# EAGLE design reg_MIC29752 (EAGLE 9.4.1)
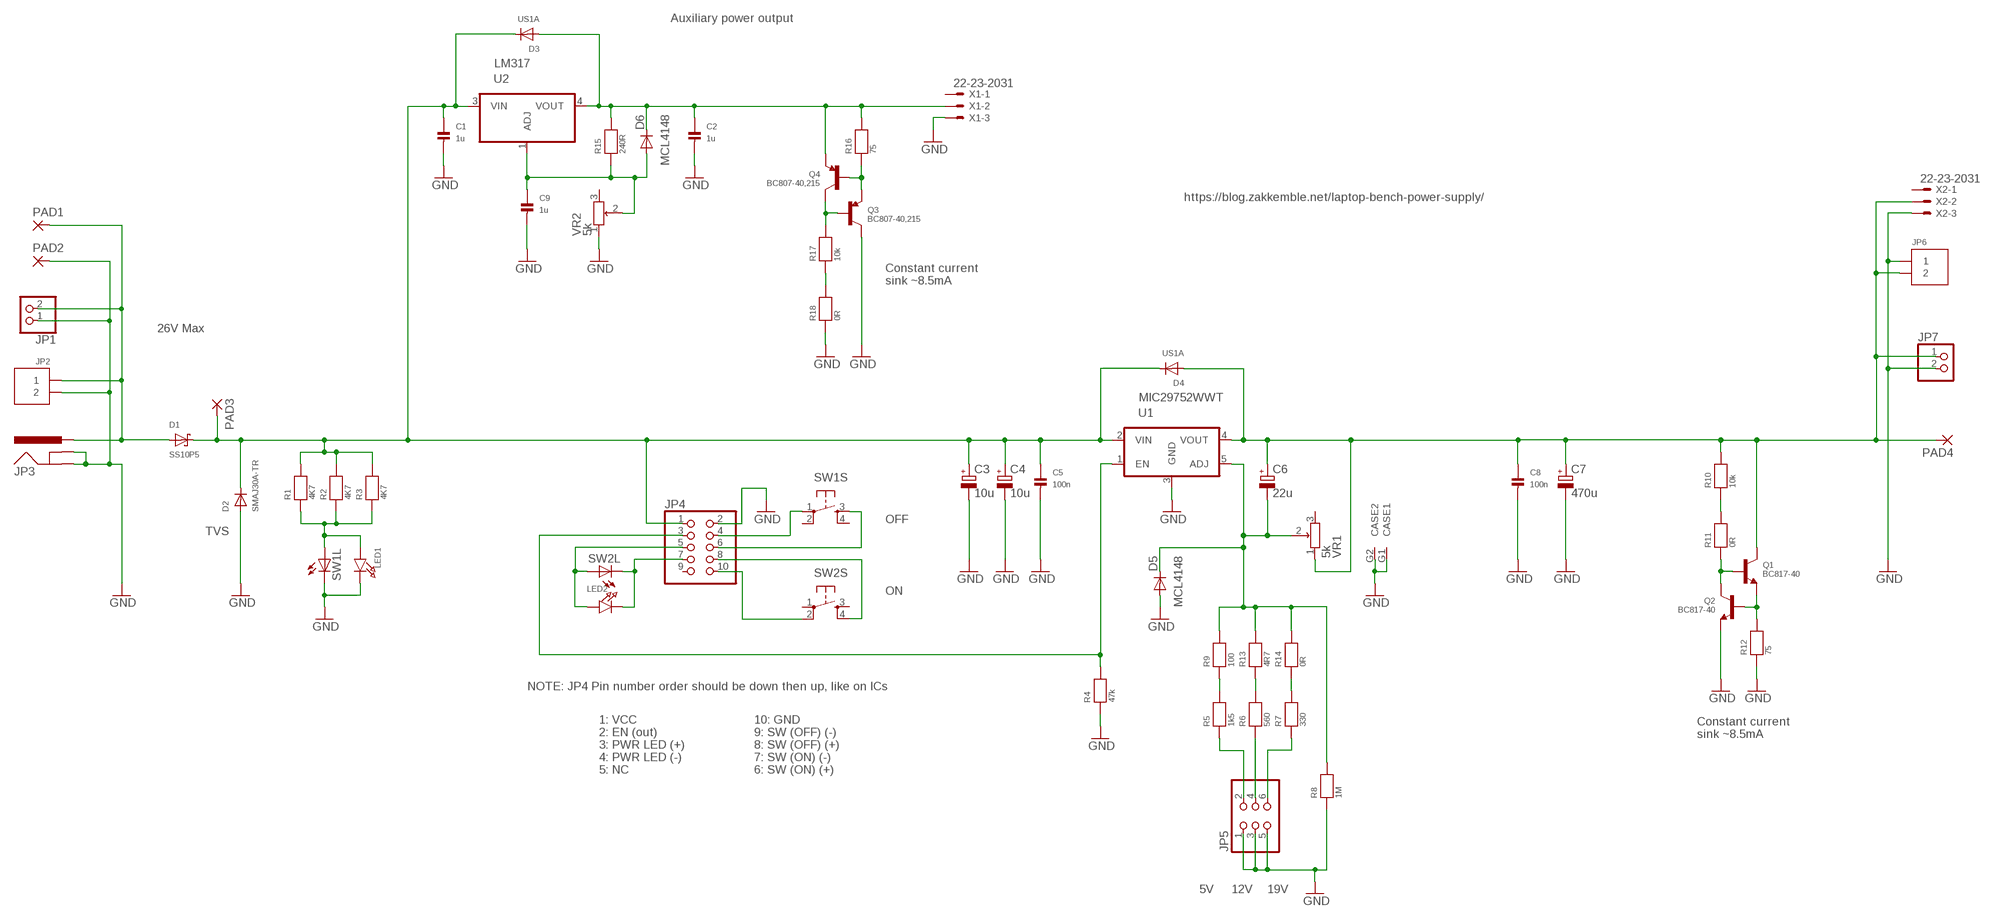
[diagram p0: schematic, sheet 1]

## Parts
C1  1u  CAP_CERAMIC0805  [0805_NO_OUTLINE]
C2  1u  CAP_CERAMIC0805  [0805_NO_OUTLINE]
C3  10u  CPOL-EUE2-5  [E2-5]
C4  10u  CPOL-EUE2-5  [E2-5]
C5  100n  CAP_CERAMIC_0603MP  [_0603MP]
C6  22u  CPOL-EUE2-4  [E2-4]
C7  470u  CPOL-EUE5-10.5  [E5-10,5]
C8  100n  CAP_CERAMIC_0603MP  [_0603MP]
C9  1u  CAP_CERAMIC0805  [0805_NO_OUTLINE]
D1  SS10P5  DIODE-SCHOTTKYTO-277A  [TO-277A]
D2  SMAJ30A-TR  DIODESMA  [SMADIODE]
D3  US1A  DIODESMA  [SMADIODE]
D4  US1A  DIODESMA  [SMADIODE]
D5  MCL4148  DIODE-MICROMELF-R  [MICROMELF-R]
D6  MCL4148  DIODE-MICROMELF-R  [MICROMELF-R]
JP1  PINHD-1X2  [1X02]
JP2  TERM_BLOCK_2WAY  [TERM_2WAY]
JP3  POWER_JACKPTH_HIGHCURRENT  [POWER_JACK_PTH_HIGHCURRENT]
JP4  PINHD-2X5  [2X05]
JP5  PINHD-2X3  [2X03]
JP6  TERM_BLOCK_2WAY  [TERM_2WAY]
JP7  PINHD-1X2  [1X02]
LED1  LED0603_NOOUTLINE  [CHIPLED_0603_NOOUTLINE]
LED2  LED0603_NOOUTLINE  [CHIPLED_0603_NOOUTLINE]
PAD1  WIREPAD-3.81,2SCREW-3MM  [SCREWPAD-3MM]
PAD2  WIREPAD-3.81,2SCREW-3MM  [SCREWPAD-3MM]
PAD3  WIREPAD-3.81,2SCREW-3MM  [SCREWPAD-3MM]
PAD4  WIREPAD-3.81,2SCREW-3MM  [SCREWPAD-3MM]
Q1  BC817-40  TRANSISTOR_NPNWAVE  [SOT23-W]
Q2  BC817-40  TRANSISTOR_NPNWIDE  [SOT23-WIDE]
Q3  BC807-40,215  TRANSISTOR_PNPSOT23-WAVE  [SOT23-W]
Q4  BC807-40,215  TRANSISTOR_PNPWIDE  [SOT23-WIDE]
R1  4K7  RESISTOR0402  [0402]
R2  4K7  RESISTOR0402  [0402]
R3  4K7  RESISTOR0402  [0402]
R4  47k  RESISTOR0402  [0402]
R5  1k5  RESISTOR0402  [0402]
R6  560  RESISTOR0402  [0402]
R7  330  RESISTOR0402  [0402]
R8  1M  RESISTOR0402  [0402]
R9  100  RESISTOR0402  [0402]
R10  10k  RESISTOR0402  [0402]
R11  0R  RESISTOR0402  [0402]
R12  75  RESISTOR0402  [0402]
R13  4R7  RESISTOR0402  [0402]
R14  0R  RESISTOR0402  [0402]
R15  240R  RESISTOR0402  [0402]
R16  75  RESISTOR0402  [0402]
R17  10k  RESISTOR0402  [0402]
R18  0R  RESISTOR0402  [0402]
SW1  SPST_TACT_LED12MM_TH  [TACT_TH_12MM_LED]
SW2  SPST_TACT_LED12MM_TH  [TACT_TH_12MM_LED]
U1  MIC29752WWT  REGULATOR_3_ADJ_ENTO247-5-REVERSE  [TO247-5-REVERSE]
U2  LM317  REGULATOR_3_ADJDPAK  [DPAK]
VR1  5k  POTENTIOMETER_RV09RV09  [RV09]
VR2  5k  POTENTIOMETERBOURNS3MM  [TRIMPOT_BOURNS3MM]
X1  22-23-2031  [22-23-2031]
X2  22-23-2031  [22-23-2031]

## Nets
GND: C1.2 C2.2 C3.- C4.- C5.2 C7.- C8.2 C9.2 D2.A D5.A JP1.1 JP2.2 JP3.C1(GNDBREAK) JP3.C2(GNDBREAK) JP3.C3(GNDBREAK) JP3.C4(GNDBREAK) JP3.GND JP4.2 JP5.1 JP5.3 JP5.5 JP6.1 JP7.2 LED1.C PAD2.1(P) Q2.2(E) Q3.3(C) R4.1 R8.1 R12.1 R18.1 SW1.5(L:C) U1.3(GND) VR1.G1(CASE1) VR1.G2(CASE2) VR2.1(1A) X1.3 X2.3
N$1: C1.1 C3.+ C4.+ C5.1 D1.K(C) D2.C D3.C D4.C JP4.1 PAD3.1(P) R1.2 R2.2 R3.2 U1.2(VIN) U2.3(VIN)
N$2: LED1.A R1.1 R2.1 R3.1 SW1.6(L:A)
N$3: D1.1(A) D1.2(A) JP1.2 JP2.1 JP3.PWR PAD1.1(P)
N$4: R5.2 R9.1
N$5: JP4.7 LED2.C SW2.5(L:C)
N$6: R10.1 R11.2
N$7: R6.2 R13.1
N$8: JP4.10 SW2.2(S:P1)
N$9: JP4.8 SW2.4(S:S1)
N$10: C2.1 D3.A D6.C Q4.2(E) R15.2 R16.2 U2.4(VOUT) X1.2
N$11: R7.2 R14.1
N$12: JP4.6 SW1.3(S:S)
N$13: JP4.4 SW1.1(S:P)
N$14: C6.- D5.C R8.2 R9.2 R13.2 R14.2 U1.5(ADJ) VR1.2(1S)
N$16: JP5.6 R7.1
N$17: JP5.4 R6.1
N$18: C9.1 D6.A R15.1 U2.1(ADJ) VR2.2(1S)
N$19: C6.+ C7.+ C8.1 D4.A JP6.2 JP7.1 PAD4.1(P) Q1.3(C) R10.2 U1.4(VOUT) VR1.1(1A) X2.2
N$20: JP5.2 R5.1
N$21: Q1.2(E) Q2.1(B) R12.2
N$22: Q1.1(B) Q2.3(C) R11.1
N$23: Q3.2(E) Q4.1(B) R16.1
N$24: Q3.1(B) Q4.3(C) R17.2
N$25: R17.1 R18.2
N$29: JP4.3 R4.2 U1.1(EN)
N$30: JP4.5 LED2.A SW2.6(L:A)
Unconnected: JP4.9 SW1.2(S:P1) SW1.4(S:S1) SW2.1(S:P) SW2.3(S:S) VR1.3(1E) VR2.3(1E) X1.1 X2.1

## Notes on the sheet
- Auxiliary power output
- https://blog.zakkemble.net/laptop-bench-power-supply/
- Constant current
  sink ~8.5mA
- 26V Max
- OFF
- TVS
- ON
- NOTE: JP4 Pin number order should be down then up, like on ICs
- Constant current
  sink ~8.5mA
- 1: VCC
  2: EN (out)
  3: PWR LED (+)
  4: PWR LED (-)
  5: NC
- 10: GND
  9: SW (OFF) (-)
  8: SW (OFF) (+)
  7: SW (ON) (-)
  6: SW (ON) (+)
- 5V | 12V | 19V

## Library data of the parts
C1 C2 C9 = zak:CAP_CERAMIC
C3 C4 C6 C7 = resistor:CPOL-EU: POLARIZED CAPACITOR, European symbol
C5 C8 = microbuilder:CAP_CERAMIC: Ceramic Capacitors 0402 - 0402 Surface Mount Capacitors 16pF 50V 5% [Digikey: 445-4899-2-ND] 18pF 50V 5% [Digikey: 490-1281-2-ND] 22pF 50V 5% [Digikey: 490-1283-2-ND] 68pF 50V 5% [Digikey: 490-1289-2-ND] 0.1uF 10V 10% [Digikey: 490-1318-2-ND] 1.0uF 6.3V 10% [Digikey: 490-1320-2-ND] 0603 - 0603 Surface Mount Capacitors 16 pF 50V 5% [Digikey: 445-5051-2-ND] 22 pF 50V [Digikey: PCC220ACVTR-ND] 33 pF 50V 5% [Digikey: 490-1415-1-ND] 56pF 50V 5% [Digikey: 490-1421-1-ND] 220pF 50V 5% [Digikey: 445-1285-1-ND] 680 pF 50V 2200 pF 50V 5% C0G [Digikey: 445-1297-1-ND] 5600 pF 100V 5% X7R [Digikey: 478-3711-1-ND] 0.1 µF 25V 10% [Digikey: PCC2277TR-ND] 0.22 µF 16V 10% X7R [Digikey: 445-1318-1-ND] 1.0 µF 25V 10% [Digikey: 445-5146-2-ND] 0603 - RF Specific 3pF 250V +/-0.1pF RF [Digikey: 712-1347-1-ND] 18 pF 250V 5% [Digikey: 478-3505-1-ND or 712-1322-1-ND] 56 pF 250V 5% C0G RF [Digikey: 490-4867-1-ND] 68 pF 250V RF [Digikey: 490-4868-1-ND] 0805 - 0805 Surface Mount Capacitors 220 pF 250V 2% RF Ceramic Capacitor [Digikey: 712-1398-1-ND] 1000 pF 50V 2% NP0 Ceramic Capacitor [Digikey: 478-3760-1-ND] 0.1 µF 25V 10% Ceramic Capacitor [Digikey: PCC1828TR-ND] 1.0 µF 16V 10% Ceramic Capacitor[Digikey: 490-1691-2-ND] 10.0 µF 10V 10% Ceramic Capacitor[Digikey: 709-1228-1-ND] 10.0 uF 16V 10% Ceramic Capacitor [Digikey: 478-5165-2-ND] 47 uF 6.3V 20% Ceramic Capacitor [Digikey: 587-1779-1-ND or 399-5506-1-ND] 1206 - 1206 Surface Mount Capacitors 47uF 10V 20% Ceramic Capacitor [Digikey: 490-5528-1-ND or 399-5508-1-ND or 445-6010-1-ND] 100uF 6.3V -20%, +80% Y5V Ceramic Capacitor (Digikey: 490-4512-1-ND, Mouser: 81-GRM31CF50J107ZE1L)
D1 = zak:DIODE-SCHOTTKY
D2-D4 = microbuilder:DIODE: Diode SMA Model Volts Amps Type Vf Vr Digikey # Notes SSA34-E3 40V 3A Schottky 480mV @ 3A 200uA @ 40V SSA34-E3/61TGITR-ND CDBA120-G 20V 1A Schottky 500mV @ 1A 500uA @ 20V 641-1014-6-ND REEL MBRA210 10V 2A Schottky 350mV @ 2A 700uA @ 10V MBRA210LT3 SOD-123 Model Volts Amps Type Vf Vr Order # Notes BAT54T1G 30V 200mA Schottky 800mV @ 200mA 2uA @ 25V BAT54T1GOSTR-ND B0530W 30V 500mA Schottky 430mV @ 500mA 130uA @ 30V B0530W-FDICT-ND REEL MBR120 1A 20V Schottky 340mV @ 1A MBR120VLSFT1GOSCT-ND SOD-323 Model Volts Amps Type Vf Vr Order # Notes PMEG2005EJ 20V 500mA Schottky 355mV @ 500mA 568-4110-1-ND ZLLS410 10V 570mA Schottky 380mV @ 570mA ZLLS410CT-ND 1N4148WS 75V 150mA Silicon/Simple 1V 1N4148WSFSCT-ND REEL SOD-523 Model Volts Amps Type Vf Vr Order # Notes BAT54XV2 30V 200mA Schottky 0.8V @ 100mA BAT54XV2CT-ND TB751S 30V 30mA Schottky RB751S-40TE61CT-ND SOT23-R/W (R = Solder Paste/Reflow Ovens, W = Hand-Soldering) Model Volts Amps Type Vf Vr Order # Notes BAT54FILM 40V 300mA Schottky 497-7162-1-ND
D5 D6 = diode:DIODE-: DIODE
JP1 JP7 = pinhead:PINHD-1X2: PIN HEADER
JP2 JP6 = zak:TERM_BLOCK_2WAY
JP3 = zak:POWER_JACK
JP4 = pinhead:PINHD-2X5: PIN HEADER
JP5 = pinhead:PINHD-2X3: PIN HEADER
LED1 LED2 = microbuilder:LED: LED 0603 - 0603 Surface Mount Package 2mA: Green LED - Low Power (3.9mcd, 2ma, 1.7Vf) - Digikey: 475-2709-2-ND Orange LED - Low Power (9.8mcd, 2ma, 1.8Vf) - Digikey: 475-1194-2-ND Red LED - Low Power (5mcd, 2ma, 1.8Vf) - Digikey: 475-1195-2-ND Yellow LED - Low Power (7mcd, 2ma, 1.8Vf) - Digikey: 475-1196-2-ND 5mA: Blue LED - Low Power (17mcd, 5ma, 2.9Vf) - Digikey: LNJ937W8CRACT-ND 0805 - 0805 Surface Mount Package 2mA: Red LED (8.8mcd, 2mA, 1.8Vf, Clear) - Low Power [Digikey: 475-2510-1-ND] Green LED (5mcd, 2mA, 1.8Vf, Clear) - Low Power [Digikey: 475-2730-1-ND] Yellow LED (11.3mcd, 2mA, 1.8Vf, Clear) - Low Power [Digikey: 475-2555-1-ND] 20mA: Red LED (104mcd, 20mA, Diffused) - LS R976 [Digikey: 475-1278-6-ND] Red LED (12mcd, 20mA, 2.0Vf, Clear) - APT2012EC [Digikey: 754-1128-1-ND] Green LED (15mcd, 20mA, 2.2Vf, Clear) - APT2012GC [Digikey: 754-1131-1-ND] Orange LED (160mcd, 20mA, 2.1Vf, Clear) - APT2012SECK [Digikey: 754-1130-1-ND] 1206 - 1206 Surface Mount Package Green LED (26mcd, 20mA, Diffused) - LG N971 [Digikey: 475-1407-6-ND] Red LED (15mcd, 20mA, Diffused) - LH N974 [Digikey: 475-1416-6-ND]
PAD1-PAD4 = zak:WIREPAD-3.81,2
Q1 Q2 = microbuilder:TRANSISTOR_NPN: NPN Transistor Transistor (NPN) 500mA 45V - BC817 [Digikey: 568-1631-1-ND] Transistor (NPN) 500mA 45V - BC817,215 [Mouser: 771-BC817-T/R] SOT23-R - SOT23 footprint optimised for use with solder paste and reflow ovens. SOT23-W - SOT23 footprint optimised for hand-soldering (larger pads).
Q3 Q4 = microbuilder:TRANSISTOR_PNP: PNP Transistor Transistor (PNP) 800mA 60V, 1.6V VCE @ 500mA [Digikey: MMBT2907AFSTR-ND] Transistor (PNP) Low Sat - 1.5A 20V, 260mV VCE @ 400mA [Digikey: ZXTP25020DFLTR-ND] SOT23-R - SOT23 footprint optimised for use with solder paste and reflow ovens. SOT23-W - SOT23 footprint optimised for hand-soldering (larger pads).
R1-R18 = zak:RESISTOR
SW1 SW2 = zak:SPST_TACT_LED
U1 = zak:REGULATOR_3_ADJ_EN
U2 = zak:REGULATOR_3_ADJ
VR1 = zak:POTENTIOMETER_RV09
VR2 = zak:POTENTIOMETER
X1 X2 = con-molex:22-23-2031: .100" (2.54mm) Center Header - 3 Pin; MF: MOLEX; MPN: 22-23-2031; OC_FARNELL: 1462950; OC_NEWARK: 30C0862

## Board
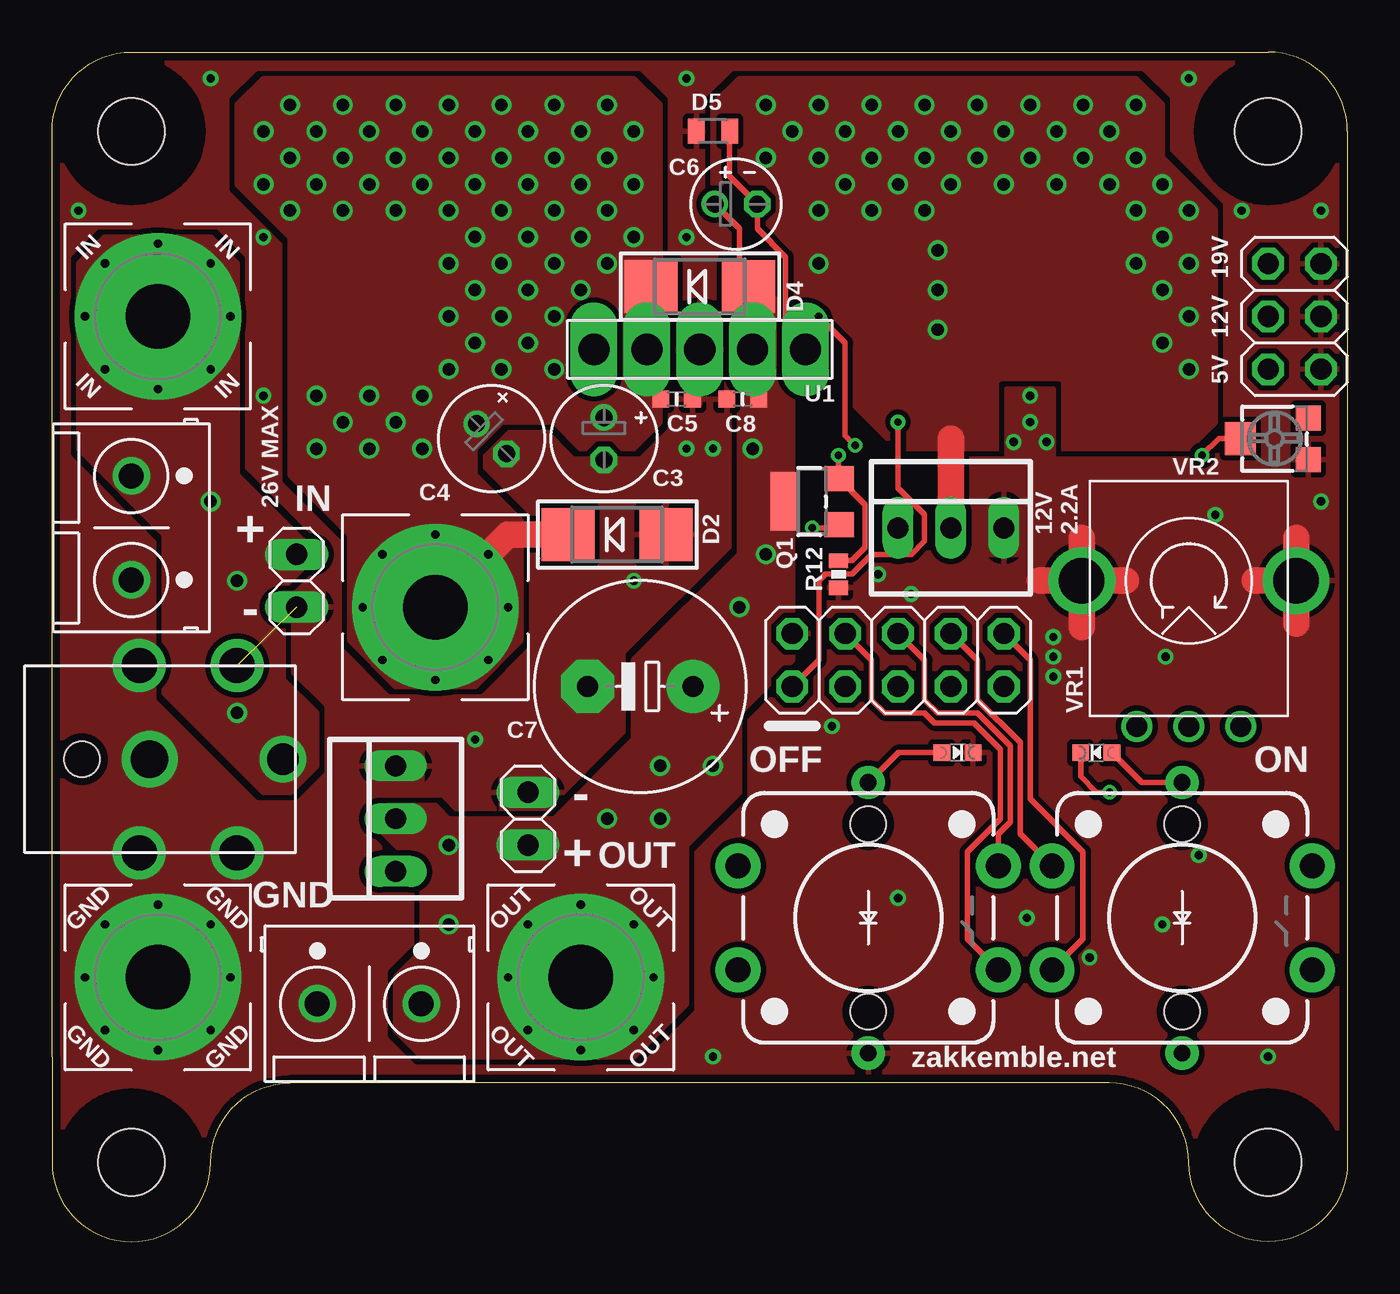
[diagram p1: board, top side]
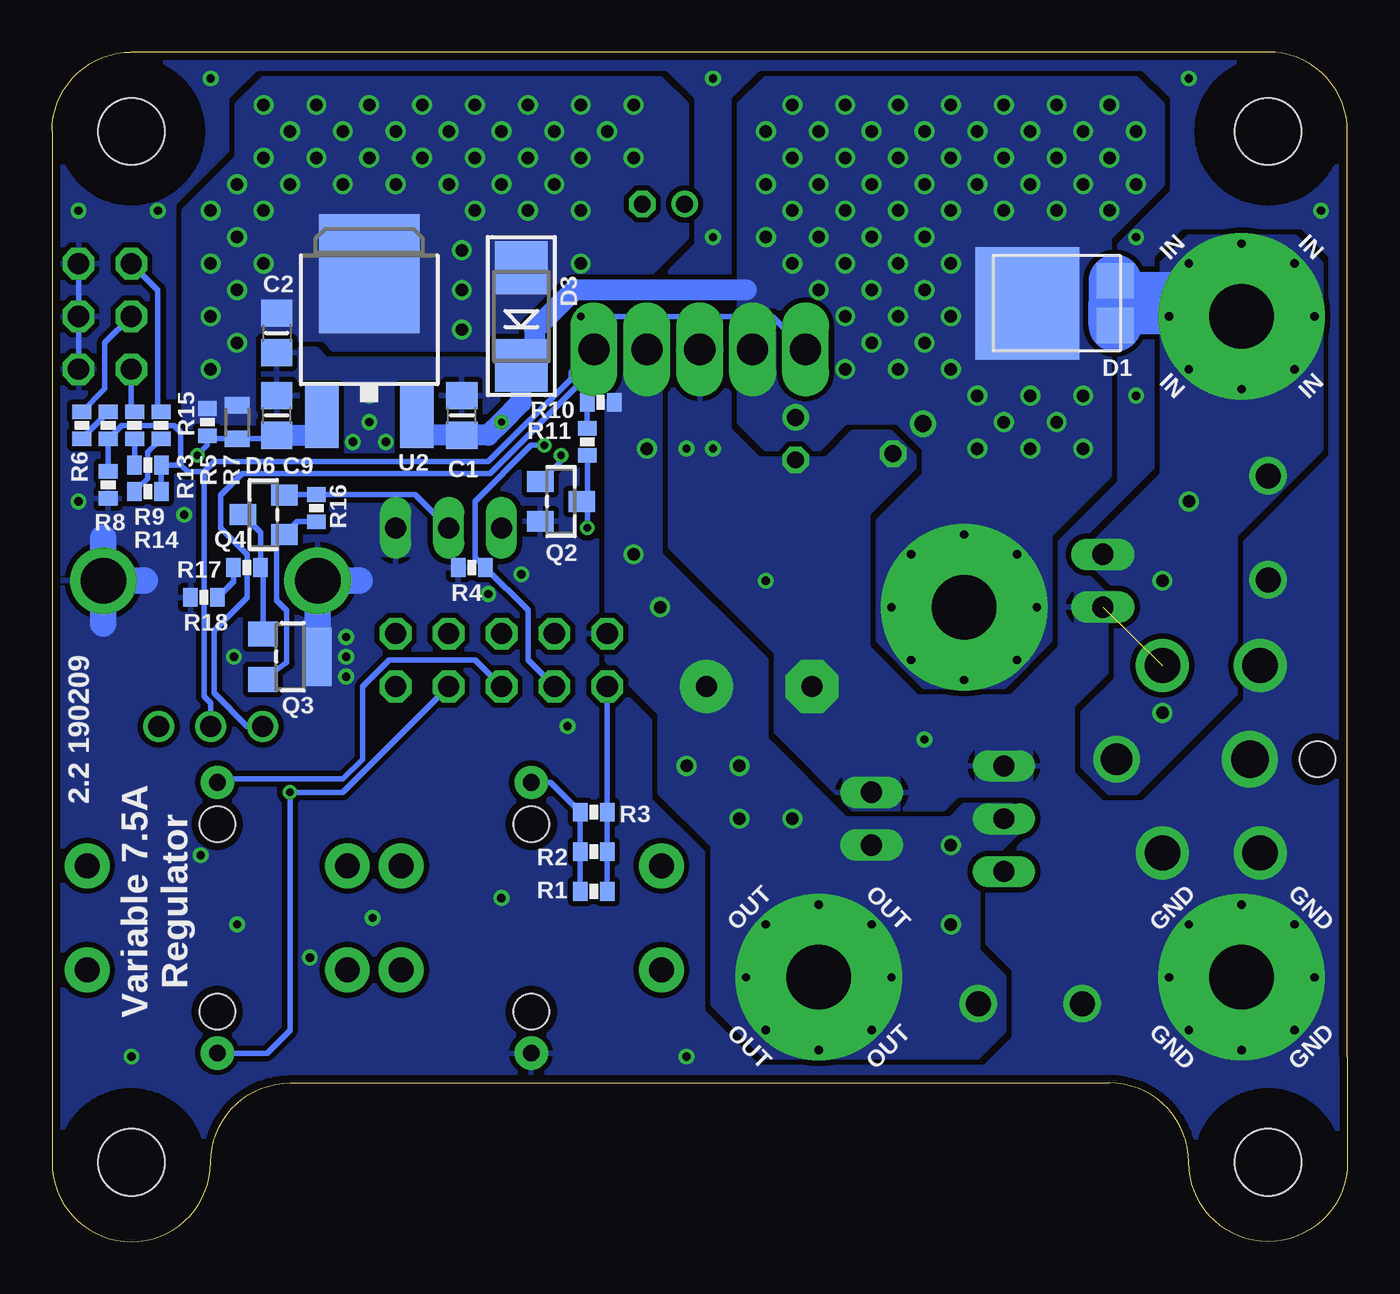
[diagram p2: board, bottom side, seen from below]

Size 62.23 x 57.15 mm. Coordinates in mm from the lower left corner, seen from the top.
Outline: 3.81,57.15 58.42,57.15 arc-90 62.23,53.34 62.23,3.81 arc-90 58.42,0 arc-90 54.61,3.81 arc90 50.8,7.62 11.43,7.62 arc90 7.62,3.81 arc-90 3.81,0 arc-90 0,3.81 0,8.89 0,48.26 0,53.34 arc-90 3.81,57.15
Copper layers (1*16): Top 0.0356mm / dielectric 1.5011mm / Bottom 0.0356mm
Design rules "LaenPCBOrder *": minimum track width 6mil, minimum drill 13mil, track to track 6mil, track to pad 6mil, pad to pad 6mil, via to via 6mil, smd to smd 6mil, copper to edge 15mil, drill to drill 6mil, minimum pad ring 7mil, minimum via ring 7mil, stop-mask expansion 4mil, vias tented up to drill 26mil, thermal gap 10mil
Holes 3.2 mm at 3.81,3.81 58.42,3.81 3.81,53.34 58.42,53.34
tRestrict: area 0.6,0.6 to 7,7; area 55.2,0.6 to 61.6,7; area 0.6,50.2 to 7,56.5; area 55.2,50.2 to 61.6,56.5
bRestrict: area 0.6,0.6 to 7,7; area 55.2,0.6 to 61.6,7; area 0.6,50.2 to 7,56.5; area 55.2,50.2 to 61.6,56.5

### Footprints (pad centres in the part's own frame; a part is rotated, then mirrored left to right if it is on the bottom)
0805_NO_OUTLINE = smd 1.3 x 1.5: 1 -0.95,0; 2 0.95,0
E2-5 = drill 0.813 pad 1.27: + -1.016,0 | drill 0.813 pad 1.27 octagon: - 1.016,0
_0603MP = smd 0.8 x 0.8: 1 -0.762,0; 2 0.762,0
E2-4 = drill 0.813 pad 1.27: + -1.016,0 | drill 0.813 pad 1.27 octagon: - 1.016,0
E5-10,5 = drill 1.016 pad 2.54: + -2.54,0 | drill 1.016 pad 2.54 octagon: - 2.54,0
TO-277A = smd 1.7 x 1.8: 1 1.065,-1.535; 2 -1.065,-1.535 | smd 5.4 x 5: K 0,2.68
SMADIODE = smd 2.54 x 2.54: A 2.349,0; C -2.349,0
MICROMELF-R = smd 0.8 x 1.2: A 0.8,0; C -0.8,0
1X02 = drill 1.016 long: 1 -1.27,0; 2 1.27,0
TERM_2WAY = drill 1.2: 1 -2.5,0; 2 2.5,0
POWER_JACK_PTH_HIGHCURRENT = drill 1.7: C1 -4.5,4.7; C2 -4.5,0; C3 4.5,4.7; C4 4.5,0 | drill 1.8: GND 0,4.2 | drill 1.5: PWR 0,-2.2 | hole 1.7: 0,7.45
2X05 = drill 1.016 octagon: 1 -5.08,-1.27; 2 -5.08,1.27; 3 -2.54,-1.27; 4 -2.54,1.27; 5 0,-1.27; 6 0,1.27; 7 2.54,-1.27; 8 2.54,1.27; 9 5.08,-1.27; 10 5.08,1.27
2X03 = drill 1.016 octagon: 1 -2.54,-1.27; 2 -2.54,1.27; 3 0,-1.27; 4 0,1.27; 5 2.54,-1.27; 6 2.54,1.27
CHIPLED_0603_NOOUTLINE = smd 0.8 x 0.8: A 0,-0.75; C 0,0.75
SCREWPAD-3MM = drill 3.1 pad 8: 1 0,0
SOT23-W = smd 1.2 x 1.4: 1 -1.1,-1.3; 2 1.1,-1.3 | smd 2.8 x 1.4: 3 0,1.3
SOT23-WIDE = smd 1 x 1.27: 1 -0.95,-1; 2 0.95,-1; 3 0,1
0402 = smd 0.7 x 0.9: 1 -0.65,0; 2 0.65,0
TACT_TH_12MM_LED = drill 1.2 pad 2.159: 1 6.25,-2.5; 2 -6.25,-2.5; 3 6.25,2.5; 4 -6.25,2.5 | drill 0.8 pad 1.6: 5 0,-6.5; 6 0,6.5 | hole 1.7: 0,4.5; 0,-4.5
TO247-5-REVERSE = drill 1.499 long: 1 -5.08,0; 2 -2.54,0; 3 0,0; 4 2.54,0; 5 5.08,0
DPAK = smd 1.6 x 3: 1 -2.28,-5.31; 3 2.28,-5.31 | smd 4.826 x 5.715: 4 0,1.588
RV09 = drill 1: 1 -2.5,-7; 2 0,-7; 3 2.5,-7 | drill 2.2: G1 -5.15,0; G2 5.15,0
TRIMPOT_BOURNS3MM = smd 1.2 x 1.2: 1 -1,-1.6; 3 1,-1.6 | smd 1.6 x 1.5: 2 0,1.65
22-23-2031 = drill 1 long: 1 -2.54,0; 2 0,0; 3 2.54,0

### Placement (x,y rotation side)
C1  42.55,39.69 90 bottom
C2  51.44,43.66 270 bottom
C3  26.51,38.58 270 top
C4  21.11,38.58 315 top
C5  30,40.48 0 top
C6  32.86,49.85 0 top
C7  28.26,26.67 180 top
C8  33.18,40.48 180 top
C9  51.44,39.69 90 bottom
D1  12.7,45.09 90 bottom
D2  27.15,33.97 0 top
D3  39.69,44.45 90 bottom
D4  31.11,45.88 0 top
D5  31.75,53.34 180 top
D6  53.34,39.37 270 bottom
JP1  11.75,31.75 90 top
JP2  3.81,34.29 270 top
JP3  8.89,23.18 90 top
JP4  40.64,27.94 0 top
JP5  59.69,44.45 90 top
JP6  15.24,11.43 0 top
JP7  22.86,20.32 90 top
LED1  43.5,23.49 270 top
LED2  50.16,23.49 90 top
PAD1  5.08,44.45 0 top
PAD2  5.08,12.7 0 top
PAD3  18.41,30.48 0 top
PAD4  25.4,12.7 0 top
Q1  36.51,35.56 90 top
Q2  37.78,35.56 270 bottom
Q3  50.8,28.1 270 bottom
Q4  52.07,34.92 90 bottom
R1  36.21,16.83 0 bottom
R2  36.21,18.73 0 bottom
R3  36.21,20.64 0 bottom
R4  42.07,32.38 0 bottom
R5  58.26,39.21 270 bottom
R6  60.8,39.21 270 bottom
R7  56.99,39.21 270 bottom
R8  59.53,36.35 90 bottom
R9  57.63,37.31 0 bottom
R10  35.88,40.32 0 bottom
R11  36.51,38.42 90 bottom
R12  37.78,32.07 90 top
R13  59.53,39.21 270 bottom
R14  57.63,36.04 0 bottom
R15  54.77,39.37 90 bottom
R16  49.53,35.24 90 bottom
R17  52.86,32.38 0 bottom
R18  54.93,30.96 0 bottom
SW1  39.21,15.56 0 top
SW2  54.29,15.56 0 top
U1  31.11,42.86 0 top
U2  46.99,44.93 0 bottom
VR1  54.61,31.75 0 top
VR2  58.74,38.58 90 top
X1  43.18,34.29 0 top
X2  16.51,20.32 90 top

### Tracks (layer width: path | path; a pad name or v marks a point on that pad's centre or on a via)
GND  (via drill 0.4)  (1 unrouted)
  Top 1.016: U1.3 31.11,41.59
  Top 1.27: U1.3 31.11,44.13 | VR1.G2 59.76,33.81 | VR1.G2 57.79,31.75 | VR1.G2 59.76,29.69 | VR1.G1 49.46,33.81 | VR1.G1 51.59,31.75 | VR1.G1 49.46,29.53 | VR1.G1 47.47,31.75
  Bottom 0.254: JP5.1 JP5.3 JP5.5
  Bottom 1.27: U1.3 31.11,41.27 | 49.46,29.37 VR1.G1 47.47,31.75 | VR1.G2 59.76,33.81 | VR1.G2 59.76,29.69 | VR1.G2 57.79,31.75
  other vias: 5.08,16.19 7.62,15.24 8.57,12.7 7.62,10.16 5.08,9.21 2.54,10.16 1.59,12.7 2.54,15.24 40.64,16.51 30.48,38.1 31.75,38.1 30.48,48.26 30.48,55.88 7.62,55.88 54.61,55.88 27.94,31.75 58.42,8.89 10.16,40.64 53.34,15.24 49.85,13.65 55.09,18.57 41.28,31.11 37.47,24.77 39.69,32.07 55.88,34.92 60.96,35.56 57.15,49.53 60.96,49.53 1.27,49.53 20.32,24.13 31.75,8.89 10.16,48.26 53.5,28.1 46.83,15.56 46.99,39.37 46.99,40.64 46.2,38.42 47.78,38.42 48.1,28.1 48.1,29.05 48.1,27.15
  pour Top (isolate 0.254, rank 6): 0,57.15 62.23,57.15 62.23,0 0,0
  pour Bottom (isolate 0.254, rank 6): 0,57.15 0,0 62.23,0 62.23,57.15
  pour Bottom (isolate 0.254, rank 6, no thermals): 21.59,22.86 24.13,22.86 24.13,20.32 21.59,20.32
  pour Top (isolate 0.254, rank 6, no thermals): 24.13,22.86 21.59,22.86 21.59,20.32 24.13,20.32
  pour Top (isolate 0.254, rank 6, no thermals): 11.43,12.7 13.97,12.7 13.97,10.16 11.43,10.16
  pour Bottom (isolate 0.254, rank 6, no thermals): 13.97,12.7 11.43,12.7 11.43,10.16 13.97,10.16
  pour Top (isolate 0.254, rank 6, no thermals): 10.16,17.78 0,17.78 0,7.62 10.16,7.62
  pour Bottom (isolate 0.254, rank 6, no thermals): 0,17.78 10.16,17.78 10.16,7.62 0,7.62
  pour Bottom (isolate 0.254, rank 6, no thermals): 24.13,28.26 27.3,28.26 27.3,25.08 24.13,25.08
  pour Top (isolate 0.254, rank 6, no thermals): 27.3,28.26 24.13,28.26 24.13,25.08 27.3,25.08
  pour Top (isolate 0.254, rank 6, no thermals): 17.78,24.13 15.24,24.13 15.24,21.59 17.78,21.59
  pour Bottom (isolate 0.254, rank 6, no thermals): 15.24,24.13 17.78,24.13 17.78,21.59 15.24,21.59
  pour Top (isolate 0.254, rank 6, no thermals): 13.02,31.75 10.48,31.75 10.48,29.21 13.02,29.21
  pour Bottom (isolate 0.254, rank 6, no thermals): 10.48,31.75 13.02,31.75 13.02,29.21 10.48,29.21
  pour Bottom (isolate 0.254, rank 6, no thermals): 5.08,33.02 2.54,33.02 2.54,30.48 5.08,30.48
  pour Top (isolate 0.254, rank 6, no thermals): 2.54,33.02 5.08,33.02 5.08,30.48 2.54,30.48
  pour Bottom (isolate 0.254, rank 6, no thermals): 44.45,35.56 46.99,35.56 46.99,33.02 44.45,33.02
  pour Top (isolate 0.254, rank 6, no thermals): 46.99,35.56 44.45,35.56 44.45,33.02 46.99,33.02
  pour Bottom (isolate 0.254, rank 6, no thermals): 10.48,29.21 2.54,29.21 2.54,17.14 10.48,17.14
  pour Top (isolate 0.254, rank 6, no thermals): 2.54,29.21 10.48,29.21 10.48,17.14 2.54,17.14
  pour Top (isolate 0.254, rank 6, no thermals): 27.46,38.89 20.8,38.89 20.8,36.67 27.46,36.67
  pour Bottom (isolate 0.254, rank 6, no thermals): 20.8,38.89 27.46,38.89 27.46,36.67 20.8,36.67
  pour Bottom (isolate 0.254, rank 4): 41.12,42.39 49.05,42.39 49.53,42.86 51.44,42.86 52.07,42.23 52.07,37.46 38.73,37.46 38.73,40.01
  pour Top (isolate 0.254, rank 4): 45.88,37.46 45.88,40.96 48.1,40.96 48.1,37.46
  pour Bottom (isolate 0.254, rank 6, no thermals): 48.58,29.69 50.8,29.69 50.8,26.35 48.58,26.35
N$1  (via drill 0.35, 0.4, 0.6)
  Top 0.254: JP4.1 36.83,27.94 36.83,31.75 37.15,32.07 38.42,32.07 39.37,33.02 41.28,33.02 41.91,33.66 41.91,34.92 40.64,36.2 v40.64,39.37
  Top 1.27: D2.C 21.91,33.97 PAD3.1
  Bottom 0.254: R1.2 R2.2 R3.2 JP4.1
  Bottom 1.016: 28.89,45.72 37.15,45.72 39.05,43.81 39.05,42.55 39.5,42.1 D3.C 39.69,40.32 v40.64,39.37 41.27,38.74 C1.1 44.45,38.74 44.45,38.73 44.71,38.99 U2.3
  other vias: 20.95,33.02 15.88,33.02 15.88,27.94 14.92,30.48 21.91,30.48 18.41,33.97 18.41,26.99 20.95,27.94 11.43,54.61 12.7,53.34 13.97,54.61 11.43,52.07 13.97,52.07 15.24,53.34 10.16,53.34 12.7,50.8 11.43,49.53 13.97,49.53 15.24,50.8 16.51,52.07 16.51,54.61 17.78,53.34 17.78,50.8 16.51,49.53 19.05,49.53 19.05,52.07 19.05,54.61 19.05,46.99 19.05,44.45 19.05,41.91 17.78,40.64 15.24,40.64 12.7,40.64 13.97,39.37 16.51,39.37 10.16,50.8 20.32,43.18 20.32,45.72 20.32,48.26 20.32,50.8 20.32,53.34 12.7,38.1 15.24,38.1 17.78,38.1 21.59,54.61 21.59,52.07 21.59,49.53 21.59,46.99 21.59,44.45 21.59,41.91 22.86,53.34 22.86,50.8 22.86,48.26 22.86,45.72 22.86,43.18 24.13,52.07 25.4,53.34 24.13,54.61 25.4,50.8 24.13,49.53 25.4,48.26 24.13,46.99 25.4,45.72 24.13,44.45 24.13,41.91 26.67,54.61 27.94,53.34 26.67,52.07 27.94,50.8 26.67,49.53 27.94,48.26 26.67,46.99
  pour Top (isolate 0.254, rank 5, no thermals): 11.43,48.26 8.89,50.8 8.89,54.61 10.16,55.88 27.94,55.88 29.21,54.61 29.21,39.37 27.94,38.1 25.4,38.1 24.13,39.37 21.59,39.37 20.32,38.1 20.32,36.83 22.54,34.61 22.54,28.89 20.32,26.67 16.51,26.67 14.29,28.89 14.29,33.97 11.43,36.83
  pour Bottom (isolate 0.254, rank 5, no thermals): 8.89,50.8 8.89,54.61 10.16,55.88 27.94,55.88 29.21,54.61 29.21,39.37 27.94,38.1 25.4,38.1 24.13,39.37 21.59,39.37 20.32,38.1 20.32,36.83 22.54,34.61 22.54,28.89 20.32,26.67 16.51,26.67 14.29,28.89 14.29,33.97 11.43,36.83 11.43,48.26
N$2
  Top 0.254: LED1.A 40.65,23.49 SW1.6
  Bottom 0.254: R1.1 R2.1 R3.1 38.28,22.06 SW1.6
N$3  (via drill 0.4, 0.6)
  Bottom 2.3: 11.16,45.14 11.11,45.09
  Bottom 2.54: D1.1 11.16,45.14 D1.2 11.16,44.4 10.48,45.09
  Bottom 3: PAD1.1 5.72,45.09 10.48,45.09
  other vias: 5.08,47.94 8.57,44.45 5.08,40.96 1.59,44.45 2.54,46.99 7.62,46.99 7.62,41.91 2.54,41.91 8.89,25.4 8.89,31.75 7.62,35.56
  pour Top (isolate 0.254, rank 5, no thermals): 1.27,46.99 2.54,48.26 7.62,48.26 8.89,46.99 8.89,36.83 12.38,33.34 12.38,32.7 11.11,31.43 11.11,26.99 12.7,25.4 12.7,22.86 11.43,21.59 10.16,21.59 5.4,26.35 5.4,33.97 1.27,38.1
  pour Bottom (isolate 0.254, rank 5, no thermals): 10.16,21.59 5.4,26.35 5.4,33.97 1.27,38.1 1.27,46.99 2.54,48.26 7.62,48.26 8.89,46.99 8.89,36.83 12.38,33.34 12.38,32.7 11.11,31.43 11.11,26.99 12.7,25.4 12.7,22.86 11.43,21.59
N$4
  Bottom 0.254: R5.2 58.26,37.32 R9.1
N$5  (via drill 0.35)
  Top 0.254: v50.8,21.59 50.16,21.59 49.41,22.34 LED2.C
  Bottom 0.254: SW2.5 51.9,9.06 50.8,10.16 v50.8,21.59 48.26,21.59 JP4.7
N$6
  Bottom 0.254: R11.2 36.53,39.08 R10.1
N$7
  Bottom 0.254: R13.1 60.8,38.59 R6.2
N$8
  Top 0.254: JP4.10 46.99,27.94 46.99,21.27 49.53,18.73 49.53,14.55 SW2.2
N$9
  Top 0.254: JP4.8 44.45,27.94 44.45,26.04 46.51,23.97 46.51,21.59 46.51,21.11 46.51,19.59 SW2.4
N$10  (via drill 0.6)
  Top 1.27: X1.2 43.18,38.58
  Bottom 0.254: X1.2 44.78,35.89 R16.2 51.05,35.89 Q4.2
  other vias: 54.61,41.91 54.61,44.45 54.61,46.99 53.34,48.26 52.07,49.53 53.34,50.8 54.61,49.53 52.07,52.07 50.8,50.8 45.72,50.8 46.99,52.07 48.26,50.8 49.53,52.07 48.26,53.34 49.53,54.61 50.8,53.34 52.07,54.61 46.99,54.61 45.72,53.34 44.45,54.61 43.18,53.34 44.45,52.07 43.18,50.8 40.64,50.8 41.91,52.07 40.64,53.34 41.91,54.61 39.37,52.07 39.37,49.53 38.1,50.8 36.83,49.53 36.83,52.07 36.83,54.61 38.1,53.34 39.37,54.61 35.56,53.34 34.29,54.61 34.29,52.07 41.91,49.53 53.34,45.72 53.34,43.18 52.07,46.99 36.83,46.99 42.55,47.62 42.55,45.72 42.55,43.81
  pour Top (isolate 0.254, rank 5): 31.75,54.61 33.02,55.88 52.07,55.88 53.34,54.61 53.34,52.07 55.88,49.53 55.88,39.37 54.61,38.1 40.64,38.1 38.1,40.64 38.1,43.18 36.83,44.45 35.56,44.45 31.75,48.26
  pour Bottom (isolate 0.254, rank 5, no thermals): 31.75,54.61 33.02,55.88 52.07,55.88 53.34,54.61 53.34,52.07 55.88,49.53 55.88,39.37 54.61,38.1 40.64,38.1 38.1,40.64 38.1,43.18 36.83,44.45 35.56,44.45 31.75,48.26
N$11
  Bottom 0.254: R14.1 57.64,36.67 57.63,36.67 57.63,37.93 R7.2
N$12
  Top 0.254: JP4.6 41.91,27.94 41.91,26.04 42.55,25.4 44.45,25.4 46.04,23.81 46.04,20.16 45.46,19.59 SW1.3
N$13
  Top 0.254: JP4.4 39.37,27.94 39.37,26.04 40.01,25.4 41.91,25.4 42.39,24.92 44.29,24.92 45.56,23.65 45.56,20.32 43.97,18.73 43.97,14.55 SW1.1
N$14
  Top 0.254: U1.5 35.24,43.81 35.24,47.31 33.88,48.67 C6.- 32.55,51.17 D5.C
  Bottom 0.254: U1.5 37.31,41.75 37.31,41.43 41.28,37.46 54.45,37.46 54.93,36.99 | R8.2 R13.2 58.88,39.21 56.36,39.21 56.04,38.89 56.04,37.31 | 56.99,37.32 R9.2 | R14.2 R9.2 | 56.04,37.31 55.72,36.99 54.93,36.99 | R9.2 56.04,37.31 | VR1.2 54.61,25.88 54.93,26.19 54.93,36.99
N$16
  Bottom 0.254: JP5.6 57.15,45.72 57.15,40.02 R7.1
N$17
  Bottom 0.254: JP5.4 59.69,43.18 59.69,40.97 R6.1
N$18  (via drill 0.35)
  Top 0.254: VR2.2 56.04,38.58 v55.25,37.78
  Bottom 0.254: C9.1 51.6,38.57 D6.A 54.62,38.57 R15.1 54.77,38.26 v55.25,37.78
  Bottom 1.016: C9.1 49.37,38.74 49.37,38.73 49.27,38.84 U2.1
N$19  (via drill 0.4, 0.6)
  Top 0.254: C6.+ 33.02,48.67 33.02,46.32 D4.A
  Bottom 0.254: 35.56,41.27 36.83,41.27 41.2,36.91 53.1,36.91 54.13,35.88 54.13,34.29 52.86,33.02 52.86,30.96 54.45,29.37 54.45,26.35 52.85,24.75 VR1.1
  other vias: 27.94,15.24 27.94,10.16 22.86,15.24 25.4,16.19 28.89,12.7 21.91,12.7 25.4,9.21 22.86,10.16 34.29,33.02 33.66,38.1 33.02,30.48 31.75,22.86 29.21,22.86 26.67,20.32 29.21,20.32 19.05,19.05 19.05,15.24
  pour Top (isolate 0.254, rank 4, no thermals): 33.02,45.72 33.02,33.02 27.94,27.94 27.94,24.13 24.13,20.32 19.05,20.32 18.41,20.95 16.19,20.95 15.88,20.64 15.88,19.68 17.78,17.78 17.78,13.97 16.51,12.7 16.51,10.16 17.78,8.89 27.94,8.89 30.48,11.43 30.48,19.05 33.02,21.59 33.02,25.4 35.56,27.94 35.56,44.45 34.29,45.72
  pour Bottom (isolate 0.254, rank 4, no thermals): 16.51,10.16 16.51,12.7 17.78,13.97 17.78,17.78 15.88,19.68 15.88,20.64 16.19,20.95 18.41,20.95 19.05,20.32 24.13,20.32 27.94,24.13 27.94,27.94 33.02,33.02 33.02,45.72 34.29,45.72 35.56,44.45 35.56,27.94 33.02,25.4 33.02,21.59 30.48,19.05 30.48,11.43 27.94,8.89 17.78,8.89
N$20
  Bottom 0.254: JP5.2 58.42,40.02 R5.1
N$21  (via drill 0.35)
  Top 0.254: R12.2 38.43,32.72 39.05,33.34 39.05,35.42 Q1.2 37.78,36.69 v37.78,37.78
  Bottom 0.254: Q2.1 37.78,37.51 v37.78,37.78
N$22  (via drill 0.35)
  Top 0.254: Q1.1 37.64,34.29 v36.51,34.29
  Bottom 0.254: 36.53,35.81 Q2.3 | v36.51,34.29 36.51,35.29 Q2.3 | R11.1 36.51,35.83 Q2.3
N$23
  Bottom 0.254: Q3.2 50.96,27.82 50.96,30.32 51.44,30.8 51.44,33.61 Q4.1 50.45,34.59 R16.1
N$24
  Bottom 0.254: Q3.1 52.1,32.27 R17.2 52.21,34.07 Q4.3
N$25
  Bottom 0.254: R17.1 53.51,31.72 R18.2
N$29  (via drill 0.35)
  Top 0.254: v38.58,38.26 38.1,38.73 38.1,43.18 v36.83,44.45
  Bottom 0.254: JP4.3 39.37,27.94 39.37,30.34 R4.2 41.91,32.88 41.91,35.56 39.21,38.26 v38.58,38.26 | U1.1 27.62,44.45 v36.83,44.45
N$30
  Top 0.254: SW2.6 52.35,22.06 LED2.A
  Bottom 0.254: JP4.5 41.91,27.94 46.04,27.94 47.31,26.67 47.31,23.18 48.26,22.22 54.12,22.22 SW2.6

### Text on the board
tPlace: IN | IN | 19V | 12V | IN | IN | 5V | 26V MAX | IN | + | 12V / 2.2A | - | OFF | ON | - | + | OUT | GND | GND | GND | OUT | OUT | GND | GND | OUT | OUT | zakkemble.net
bPlace: IN | IN | IN | IN | 2.2 190209 | Variable 7.5A / Regulator | GND | GND | OUT | OUT | GND | GND | OUT | OUT
Document: This airwire for GND / to be ignored